# Altium schematic sheet Schematic.schdoc
size 321 x 263 mm
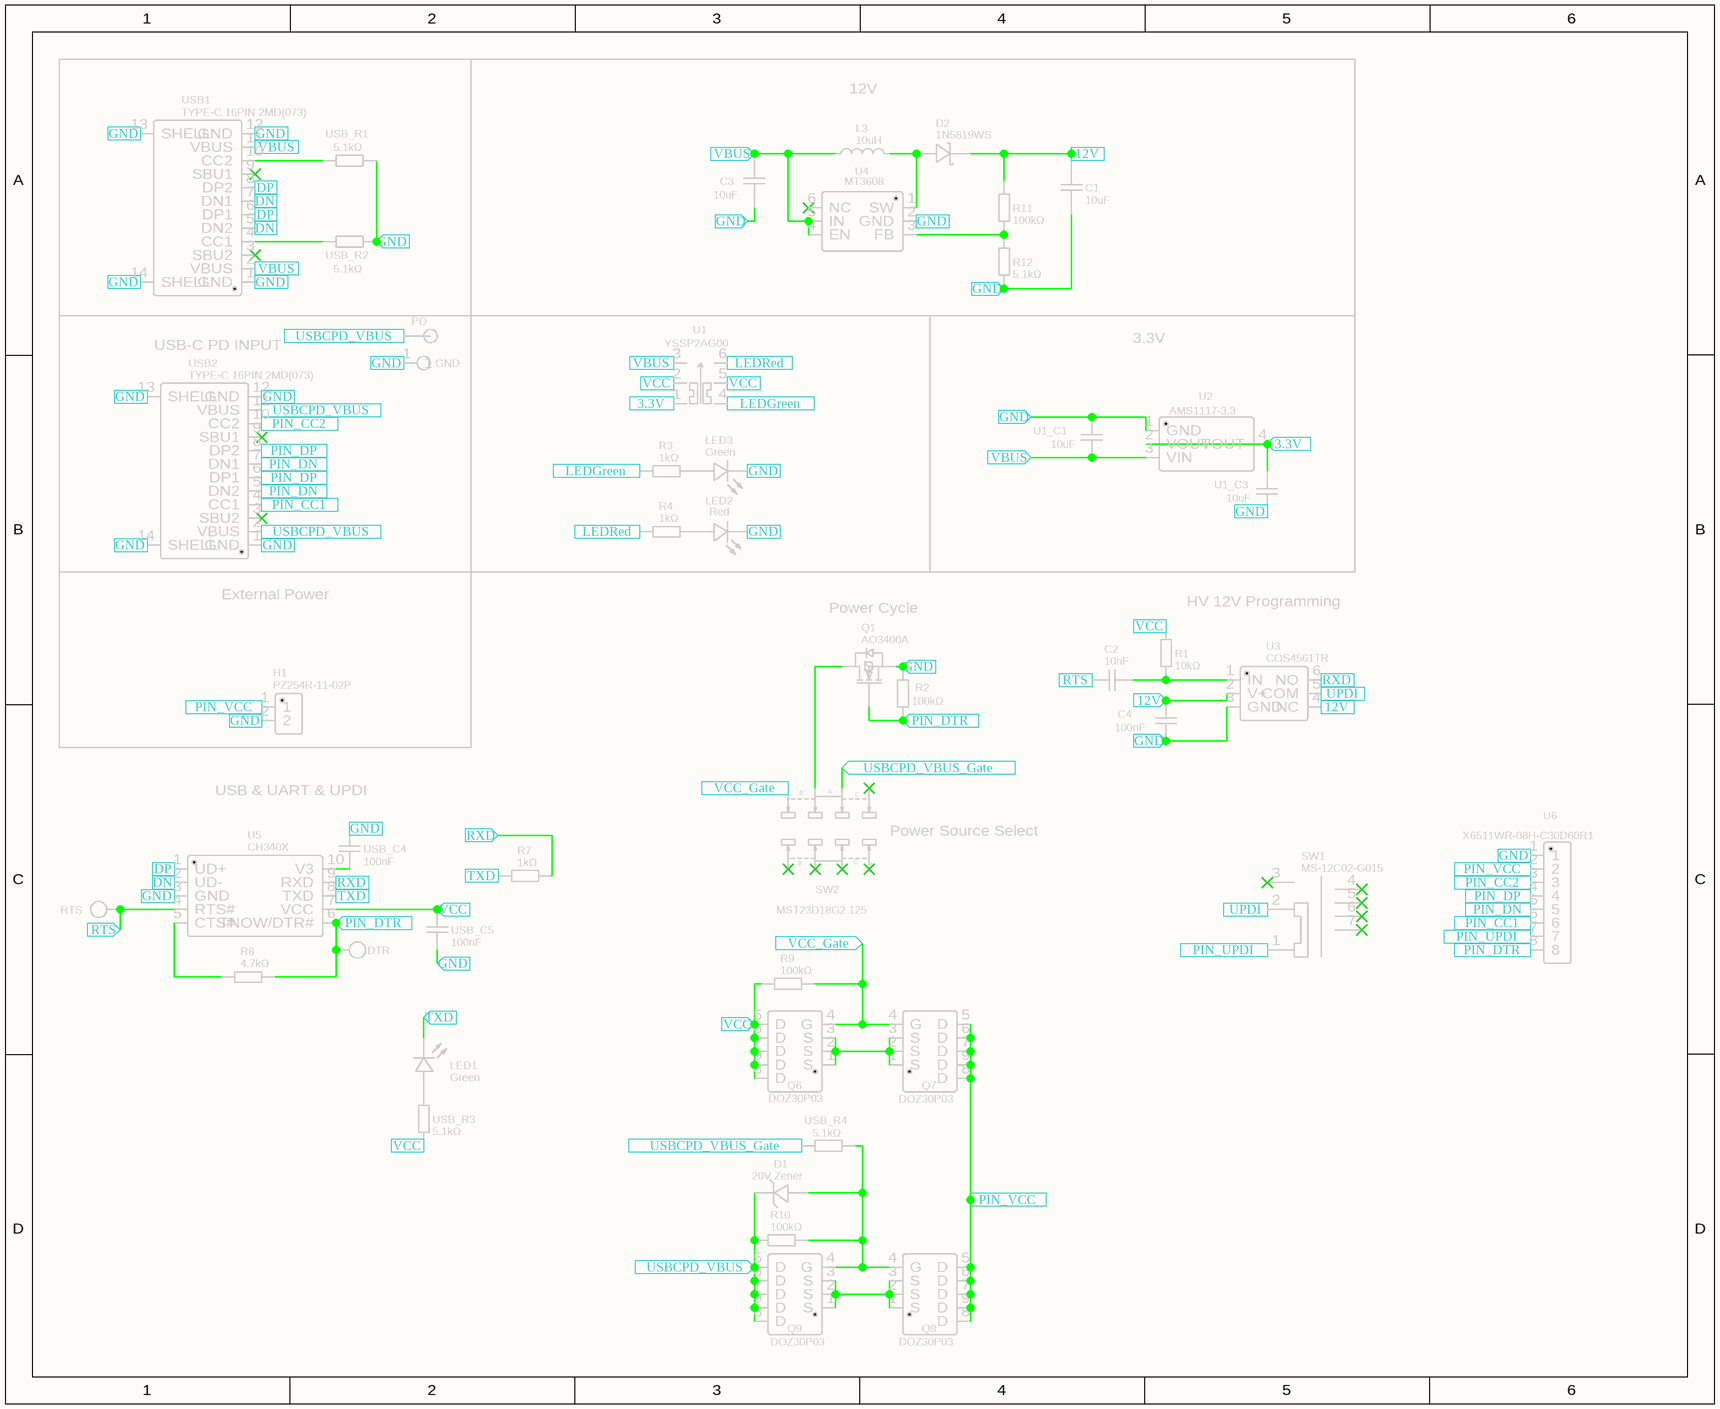
[diagram p0: Schematic.schdoc]

## Parts
C1  10uF  [C0805]
C2  10nF  [C0402]
C3  10uF  [C0805]
C4  100nF  [C0402]
D1  20V Zener  [SOD-323_L1.7-W1.3-LS2.5-RD-1]
D2  1N5819WS  [SOD-323_L1.8-W1.3-LS2.5-RD]
DTR  TESTPOINT  [TEST_TESTPOINT]  (value not drawn)
GND  CC  [RINGTESTPOINT]  (value not drawn)
H1  PZ254R-11-02P  [HDR-TH_2P-P2.54-H-M-W10.4]
L3  10uH  [IND-SMD_L2.5-W2.0]
LED1  Green  [LED0805-R-RD]
LED2  Red  [LED0805-R-RD]
LED3  Green  [LED0805-R-RD]
Q1  AO3400A  [SOT-23-3_L2.9-W1.3-P1.90-LS2.4-BR]
Q6  DOZ30P03  [PDFN-8_L3.1-W3.0-P0.65-LS3.3-BL]
Q7  DOZ30P03  [PDFN-8_L3.1-W3.0-P0.65-LS3.3-BL]
Q8  DOZ30P03  [PDFN-8_L3.1-W3.0-P0.65-LS3.3-BL]
Q9  DOZ30P03  [PDFN-8_L3.1-W3.0-P0.65-LS3.3-BL]
R1  10kΩ  [R0402]
R2  100kΩ  [R0402]
R3  1kΩ  [R0402]
R4  1kΩ  [R0402]
R7  1kΩ  [R0402]
R8  4.7kΩ  [R0402]
R9  100kΩ  [R0402]
R10  100kΩ  [R0402]
R11  100kΩ  [R0402]
R12  5.1kΩ  [R0402]
RTS  TESTPOINT  [TEST_TESTPOINT]  (value not drawn)
SW1  MS-12C02-G015  [SW-SMD_MS-12C02-G015]
SW2  MST23D18G2 125  [SW-SMD_SHOU_MST23D18G2]
U1  YSSP2AG00  [SW-SMD_YSSP2AG00]
U1_C1  10uF  [C0402]
U1_C3  10uF  [C0402]
U2  AMS1117-3.3  [SOT-223-3_L6.5-W3.4-P2.30-LS7.0-BR]
U3  COS4561TR  [SOT-23-6_L2.9-W1.6-P0.95-LS2.8-TL]
U4  MT3608  [SOT-23-6_L2.9-W1.6-P0.95-LS2.8-BL]
U5  CH340X  [MSOP-10_L3.0-W3.0-P0.50-LS5.0-BL]
U6  X6511WR-08H-C30D60R1  [HDR-TH_8P-P2.54-H-M-W7.7-P]
U7  PD  [TESTPOINT]
USB1  TYPE-C 16PIN 2MD(073)  [USB-C-SMD_TYPE-C-6PIN-2MD-073]
USB2  TYPE-C 16PIN 2MD(073)  [USB-C-SMD_TYPE-C-6PIN-2MD-073]
USB_C4  100nF  [C0402]
USB_C5  100nF  [C0402]
USB_R1  5.1kΩ  [R0402]
USB_R2  5.1kΩ  [R0402]
USB_R3  5.1kΩ  [R0402]
USB_R4  5.1kΩ  [R0402]

## Blocks framed on the sheet
12V: C1 C3 D2 L3 R11 R12 U4
USB-C PD INPUT: GND U7 USB2
3.3V: U1_C1 U1_C3 U2
External Power: H1

## Ports
3.3V (in), 12V (in), DN (in), DP (in), GND (in), LEDGreen (in), LEDRed (in), PIN_CC1 (in), PIN_CC2 (in), PIN_DN (in), PIN_DP (in), PIN_DTR (in), PIN_UPDI (in), PIN_VCC (in), RTS (in), RXD (in), TXD (in), UPDI (in), USBCPD_VBUS (in), USBCPD_VBUS_Gate (in), VBUS (in), VCC (in), VCC_Gate (in)

## Nets
3.3V: U1.1 U1_C3.2 U2.2(VOUT) U2.4(VOUT) ; port 3.3V
12V: C1.2 C4.2 D2.1(K) R11.2 U3.2(V+) U3.4(NC) ; port 12V
DN: U5.2(UD-) USB1.5(DN2) USB1.7(DN1) ; port DN
DP: U5.1(UD+) USB1.6(DP1) USB1.8(DP2) ; port DP
GND: C1.1 C3.1 C4.1 GND.1 H1.2 LED2.2(-) LED3.2(K) Q1.2(S) R2.2 R12.1 U1_C1.2 U1_C3.1 U2.1(GND) U3.3(GND) U4.2(GND) U5.3(GND) U6.1 USB1.1(GND) USB1.12(GND) USB1.13(SHELL) USB1.14(SHELL) USB2.1(GND) USB2.12(GND) USB2.13(SHELL) USB2.14(SHELL) USB_C4.2 USB_C5.1 USB_R1.2 USB_R2.2 ; port GND
LEDGreen: R3.1 U1.4 ; port LEDGreen
LEDRed: R4.1 U1.6 ; port LEDRed
PIN_CC1: U6.6 USB2.4(CC1) ; port PIN_CC1
PIN_CC2: U6.3 USB2.10(CC2) ; port PIN_CC2
PIN_DN: U6.5 USB2.5(DN2) USB2.7(DN1) ; port PIN_DN
PIN_DP: U6.4 USB2.6(DP1) USB2.8(DP2) ; port PIN_DP
PIN_DTR: DTR.1 Q1.1(G) R2.1 R8.1 U5.6(TNOW/DTR#) U6.8 ; port PIN_DTR
PIN_UPDI: SW1.1 U6.7 ; port PIN_UPDI
PIN_VCC: H1.1 Q7.5(D) Q7.6(D) Q7.7(D) Q7.8(D) Q7.9(D) Q8.5(D) Q8.6(D) Q8.7(D) Q8.8(D) Q8.9(D) U6.2 ; port PIN_VCC
RTS: C2.2 RTS.1 U5.4(RTS#) ; port RTS
RXD: R7.2 U3.6(NO) U5.9(RXD) ; port RXD
TXD: LED1.2(K) R7.1 U5.8(TXD) ; port TXD
UPDI: SW1.2 U3.5(COM) ; port UPDI
USBCPD_VBUS: D1.1(K) Q9.5(D) Q9.6(D) Q9.7(D) Q9.8(D) Q9.9(D) R10.2 U7.1 USB2.2(VBUS) USB2.11(VBUS) ; port USBCPD_VBUS
USBCPD_VBUS_Gate: SW2.3 USB_R4.2 ; port USBCPD_VBUS_Gate
VBUS: C3.2 L3.2 U1.3 U1_C1.1 U2.3(VIN) U4.4(EN) U4.5(IN) USB1.2(VBUS) USB1.11(VBUS) ; port VBUS
VCC: Q6.5(D) Q6.6(D) Q6.7(D) Q6.8(D) Q6.9(D) R1.2 R9.2 U1.2 U1.5 U5.7(VCC) USB_C5.2 USB_R3.2 ; port VCC
VCC_Gate: Q6.4(G) Q7.4(G) R9.1 SW2.1 ; port VCC_Gate
NetC2_1: C2.1 R1.1 U3.1(IN)
NetD1_2: D1.2(A) Q8.4(G) Q9.4(G) R10.1 USB_R4.1
NetD2_2: D2.2(A) L3.1 U4.1(SW)
NetLED1_1: LED1.1(A) USB_R3.1
NetLED2_1: LED2.1(+) R4.2
NetLED3_1: LED3.1(A) R3.2
NetQ1_3: Q1.3(D) SW2.2
NetQ6_1: Q6.1(S) Q6.2(S) Q6.3(S) Q7.1(S) Q7.2(S) Q7.3(S)
NetQ8_1: Q8.1(S) Q8.2(S) Q8.3(S) Q9.1(S) Q9.2(S) Q9.3(S)
NetR8_2: R8.2 U5.5(CTS#)
NetR11_1: R11.1 R12.2 U4.3(FB)
NetU5_10: U5.10(V3) USB_C4.1
NetUSB1_4: USB1.4(CC1) USB_R2.1
NetUSB1_10: USB1.10(CC2) USB_R1.1

Not connected (* = marked no-connect by the designer): SW1 3* 4* 5* 6* 7*; SW2 4* 5* 6* 7* 8*; U4 6(NC)*; USB1 3(SBU2)* 9(SBU1)*; USB2 3(SBU2)* 9(SBU1)*

## Notes on the sheet
- Power Cycle
- (near R1) HV 12V Programming
- USB & UART & UPDI
- (near SW2) Power Source Select
- (in symbol MST23D18G2 125) B; A; C

## Library data of the parts
C1 C3 = 10uF: Manufacturer Part: CL21A106KAYNNNE; Manufacturer: SAMSUNG(三星); nameAlias: Value; Supplier: LCSC; Supplier Part: C15850; JLCPCB Part Class: Basic Part; spicePre: C; spiceSymbolName: CL21A106KAYNNNE
C2 = 10nF: Manufacturer Part: CL05B103KB5NNNC; Manufacturer: SAMSUNG(三星); nameAlias: Value; Supplier: LCSC; Supplier Part: C15195; JLCPCB Part Class: Basic Part; spicePre: C; spiceSymbolName: CL05B103KB5NNNC
C4 USB_C4 USB_C5 = 100nF: Manufacturer Part: CL05B104KO5NNNC; Manufacturer: SAMSUNG(三星); nameAlias: Value; Supplier: LCSC; Supplier Part: C1525; JLCPCB Part Class: Basic Part; spicePre: C; spiceSymbolName: CL05B104KO5NNNC
D1 = 20V Zener: Manufacturer: ROHM(罗姆); Manufacturer Part: UDZVTE-1720B; Contributor: LCSC; Supplier: LCSC; Supplier Part: C209570; JLCPCB Part Class: Extended Part; spicePre: D; spiceSymbolName: UDZVTE-1720B
D2 = 1N5819WS: Manufacturer: Hottech(合科泰); Contributor: LCSC; Supplier: LCSC; Supplier Part: C191023; Manufacturer Part: 1N5819WS; JLCPCB Part Class: Basic Part; spicePre: D; spiceSymbolName: 1N5819WS
DTR RTS = TESTPOINT: Contributor: Tech Guy; spicePre: T; spiceSymbolName: TEST_TESTPOINT
GND = CC: Contributor: PAJB007; spicePre: T; spiceSymbolName: RING TEST POINT
H1 = PZ254R-11-02P: Manufacturer: XFCN(兴飞); Contributor: LCSC; Supplier: LCSC; Supplier Part: C492410; Manufacturer Part: PZ254R-11-02P; JLCPCB Part Class: Extended Part; spicePre: H; spiceSymbolName: PZ254R-11-02P
L3 = 10uH: Manufacturer: cjiang(长江微电); Manufacturer Part: FTC252012S100MBCA; nameAlias: Value; Contributor: lcsc; Supplier: LCSC; Supplier Part: C5832376; JLCPCB Part Class: Extended Part; spicePre: L; spiceSymbolName: FTC252012S100MBCA
LED1 LED3 = Green: Manufacturer: KENTO; Manufacturer Part: KT-0805G; Supplier: LCSC; Supplier Part: C2297; JLCPCB Part Class: Basic Part; spicePre: L; spiceSymbolName: 0805G (Green)
LED2 = Red: Manufacturer: 国星光电; Manufacturer Part: NCD0805R1; Supplier: LCSC; Supplier Part: C84256; JLCPCB Part Class: Basic Part; spicePre: L; spiceSymbolName: FC-2012HRK-620D
Q1 = AO3400A: Manufacturer: AOS; Supplier: LCSC; Manufacturer Part: AO3400A; Supplier Part: C20917; JLCPCB Part Class: Basic Part; spicePre: Q; spiceSymbolName: AO3400A
Q6-Q9 = DOZ30P03: Manufacturer: DOINGTER(杜因特); Contributor: lcsc; Supplier: LCSC; Supplier Part: C36499166; Manufacturer Part: DOZ30P03; JLCPCB Part Class: Extended Part; spicePre: Q; spiceSymbolName: DOZ30P03
R1 = 10kΩ: Manufacturer: UNI-ROYAL(厚声); Manufacturer Part: 0402WGF1002TCE; nameAlias: Value; Supplier: LCSC; Supplier Part: C25744; JLCPCB Part Class: Basic Part; spicePre: R; spiceSymbolName: 0402WGF1002TCE
R2 R9-R11 = 100kΩ: Manufacturer: UNI-ROYAL(厚声); Manufacturer Part: 0402WGF1003TCE; nameAlias: Value; Supplier: LCSC; Supplier Part: C25741; JLCPCB Part Class: Basic Part; spicePre: R; spiceSymbolName: 0402WGF1003TCE
R3 R4 R7 = 1kΩ: Manufacturer: UNI-ROYAL(厚声); Manufacturer Part: 0402WGF1001TCE; nameAlias: Value; Supplier: LCSC; Supplier Part: C11702; JLCPCB Part Class: Basic Part; spicePre: R; spiceSymbolName: 0402WGF1001TCE
R8 = 4.7kΩ: Manufacturer: UNI-ROYAL(厚声); Manufacturer Part: 0402WGF4701TCE; nameAlias: Value; Supplier: LCSC; Supplier Part: C25900; JLCPCB Part Class: Basic Part; spicePre: R; spiceSymbolName: 0402WGF4701TCE
R12 USB_R1-USB_R4 = 5.1kΩ: Manufacturer: UNI-ROYAL(厚声); Manufacturer Part: 0402WGF5101TCE; nameAlias: Value; Supplier: LCSC; Supplier Part: C25905; JLCPCB Part Class: Basic Part; spicePre: R; spiceSymbolName: 0402WGF5101TCE
SW1 = MS-12C02-G015: Manufacturer: G-Switch(品赞); Contributor: lcsc; Supplier: LCSC; Supplier Part: C2896618; Manufacturer Part: MS-12C02-G015; JLCPCB Part Class: Extended Part; spicePre: S; spiceSymbolName: MS-12C02-G015
SW2 = MST23D18G2 125: Manufacturer: SHOU HAN(首韩); Contributor: LCSC; Supplier: LCSC; Supplier Part: C2906281; Manufacturer Part: MST23D18G2 125; JLCPCB Part Class: Extended Part; spicePre: S; spiceSymbolName: MST23D18G2 125
U1 = YSSP2AG00: Manufacturer: YIYUAN(怡远); Contributor: lcsc; Supplier: LCSC; Supplier Part: C5188558; Manufacturer Part: YSSP2AG00; JLCPCB Part Class: Extended Part; spicePre: U; spiceSymbolName: YSSP2AG00
U1_C1 U1_C3 = 10uF: Manufacturer Part: CL05A106MQ5NUNC; Manufacturer: SAMSUNG(三星); nameAlias: Capacitance; Supplier: LCSC; Supplier Part: C15525; JLCPCB Part Class: Basic Part; spicePre: C; spiceSymbolName: CL05A106MQ5NUNC
U2 = AMS1117-3.3: Manufacturer: AMS; sourceId: dwIGgezVh; timeStamp: 1476261164; Supplier: LCSC; Manufacturer Part: AMS1117-3.3; Supplier Part: C6186; JLCPCB Part Class: Basic Part; spicePre: U; spiceSymbolName: AMS1117-3.3
U3 = COS4561TR: Manufacturer: COSINE(科山芯创); Contributor: lcsc; Supplier: LCSC; Supplier Part: C3035952; Manufacturer Part: COS4561TR; JLCPCB Part Class: Extended Part; spicePre: U; spiceSymbolName: COS4561TR
U4 = MT3608: Manufacturer: 西安航天民芯; Supplier: LCSC; Manufacturer Part: MT3608; Supplier Part: C84817; JLCPCB Part Class: Extended Part; spicePre: U; spiceSymbolName: MT3608
U5 = CH340X: Manufacturer: WCH(南京沁恒); Contributor: lcsc; Supplier: LCSC; Supplier Part: C3035748; Manufacturer Part: CH340X; JLCPCB Part Class: Extended Part; spicePre: U; spiceSymbolName: CH340X
U6 = X6511WR-08H-C30D60R1: Manufacturer: XKB Connection(中国星坤); Manufacturer Part: X6511WR-08H-C60D30R1; Contributor: LCSC; Supplier: LCSC; Supplier Part: C2883846; JLCPCB Part Class: Extended Part; spicePre: U; spiceSymbolName: X6511WR-08H-C30D60R1
U7 = PD: Contributor: Samuel Gossner; spicePre: U; spiceSymbolName: testPoint
USB1 USB2 = TYPE-C 16PIN 2MD(073): Manufacturer: SHOU HAN(首韩); Contributor: LCSC; Supplier: LCSC; Supplier Part: C2765186; Manufacturer Part: TYPE-C 16PIN 2MD(073); JLCPCB Part Class: Extended Part; spicePre: U; spiceSymbolName: TYPE-C 16PIN 2MD(073)